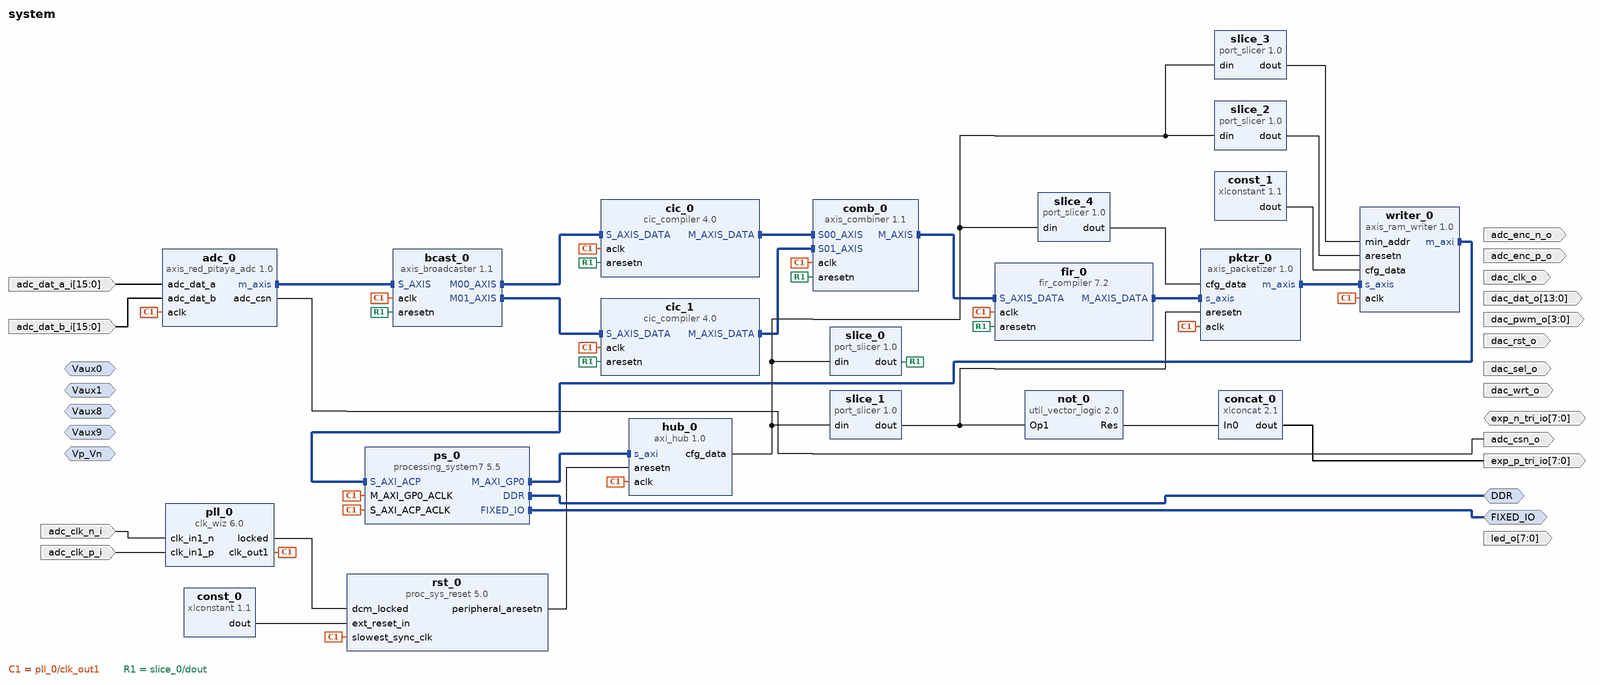
[diagram p0: block diagram of the top level]
# Vivado block design system, xc7z010clg400-1, Vivado 2023.2
create_bd_design system

create_bd_intf_port -mode Slave -vlnv xilinx.com:interface:diff_analog_io_rtl:1.0 Vp_Vn
create_bd_intf_port -mode Slave -vlnv xilinx.com:interface:diff_analog_io_rtl:1.0 Vaux0
create_bd_intf_port -mode Slave -vlnv xilinx.com:interface:diff_analog_io_rtl:1.0 Vaux1
create_bd_intf_port -mode Slave -vlnv xilinx.com:interface:diff_analog_io_rtl:1.0 Vaux9
create_bd_intf_port -mode Slave -vlnv xilinx.com:interface:diff_analog_io_rtl:1.0 Vaux8
create_bd_intf_port -mode Master -vlnv xilinx.com:interface:ddrx_rtl:1.0 DDR
create_bd_intf_port -mode Master -vlnv xilinx.com:display_processing_system7:fixedio_rtl:1.0 FIXED_IO
create_bd_port -dir I -from 15 -to 0 adc_dat_a_i
create_bd_port -dir I -from 15 -to 0 adc_dat_b_i
create_bd_port -dir I adc_clk_p_i
create_bd_port -dir I adc_clk_n_i
create_bd_port -dir O adc_enc_p_o
create_bd_port -dir O adc_enc_n_o
create_bd_port -dir O adc_csn_o
create_bd_port -dir O -from 13 -to 0 dac_dat_o
create_bd_port -dir O dac_clk_o
create_bd_port -dir O dac_rst_o
create_bd_port -dir O dac_sel_o
create_bd_port -dir O dac_wrt_o
create_bd_port -dir O -from 3 -to 0 dac_pwm_o
create_bd_port -dir IO -from 7 -to 0 exp_n_tri_io
create_bd_port -dir O -from 7 -to 0 led_o
create_bd_port -dir O -from 7 -to 0 exp_p_tri_io

create_bd_cell -type ip -vlnv xilinx.com:ip:clk_wiz:6.0 pll_0
set_property -dict [list \
  CONFIG.CLKOUT1_REQUESTED_OUT_FREQ 125.0 \
  CONFIG.CLKOUT1_USED true \
  CONFIG.PRIMITIVE PLL \
  CONFIG.PRIM_IN_FREQ 125.0 \
  CONFIG.PRIM_SOURCE Differential_clock_capable_pin \
  CONFIG.USE_RESET false \
] [get_bd_cells pll_0]
create_bd_cell -type ip -vlnv xilinx.com:ip:processing_system7:5.5 ps_0
set_property -dict [list \
  CONFIG.PCW_APU_PERIPHERAL_FREQMHZ 666.666666 \
  CONFIG.PCW_ENET0_ENET0_IO {MIO 16 .. 27} \
  CONFIG.PCW_ENET0_GRP_MDIO_ENABLE 1 \
  CONFIG.PCW_ENET0_GRP_MDIO_IO {MIO 52 .. 53} \
  CONFIG.PCW_ENET0_PERIPHERAL_ENABLE 1 \
  CONFIG.PCW_ENET0_RESET_ENABLE 0 \
  CONFIG.PCW_ENET_RESET_ENABLE 1 \
  CONFIG.PCW_ENET_RESET_SELECT {Share reset pin} \
  CONFIG.PCW_FPGA0_PERIPHERAL_FREQMHZ 50 \
  CONFIG.PCW_FPGA1_PERIPHERAL_FREQMHZ 50 \
  CONFIG.PCW_GPIO_EMIO_GPIO_ENABLE 1 \
  CONFIG.PCW_GPIO_EMIO_GPIO_IO 64 \
  CONFIG.PCW_GPIO_MIO_GPIO_ENABLE 1 \
  CONFIG.PCW_GPIO_MIO_GPIO_IO MIO \
  CONFIG.PCW_GPIO_PERIPHERAL_ENABLE 1 \
  CONFIG.PCW_I2C0_GRP_INT_ENABLE 0 \
  CONFIG.PCW_I2C0_I2C0_IO {MIO 50 .. 51} \
  CONFIG.PCW_I2C0_PERIPHERAL_ENABLE 1 \
  CONFIG.PCW_I2C_PERIPHERAL_FREQMHZ 111.111115 \
  CONFIG.PCW_I2C_RESET_ENABLE 1 \
  CONFIG.PCW_I2C_RESET_SELECT {Share reset pin} \
  CONFIG.PCW_IMPORT_BOARD_PRESET cfg/red_pitaya.xml \
  CONFIG.PCW_PRESET_BANK1_VOLTAGE {LVCMOS 2.5V} \
  CONFIG.PCW_QSPI_PERIPHERAL_ENABLE 0 \
  CONFIG.PCW_SD0_GRP_CD_ENABLE 1 \
  CONFIG.PCW_SD0_GRP_CD_IO {MIO 46} \
  CONFIG.PCW_SD0_GRP_WP_ENABLE 1 \
  CONFIG.PCW_SD0_GRP_WP_IO {MIO 47} \
  CONFIG.PCW_SD0_PERIPHERAL_ENABLE 1 \
  CONFIG.PCW_SD0_SD0_IO {MIO 40 .. 45} \
  CONFIG.PCW_SDIO_PERIPHERAL_FREQMHZ 100 \
  CONFIG.PCW_SPI0_PERIPHERAL_ENABLE 1 \
  CONFIG.PCW_SPI0_SPI0_IO EMIO \
  CONFIG.PCW_SPI1_PERIPHERAL_ENABLE 1 \
  CONFIG.PCW_SPI1_SPI1_IO {MIO 10 .. 15} \
  CONFIG.PCW_UART0_PERIPHERAL_ENABLE 1 \
  CONFIG.PCW_UART0_UART0_IO {MIO 14 .. 15} \
  CONFIG.PCW_UART1_PERIPHERAL_ENABLE 1 \
  CONFIG.PCW_UART1_UART1_IO {MIO 8 .. 9} \
  CONFIG.PCW_UART_PERIPHERAL_FREQMHZ 100 \
  CONFIG.PCW_UIPARAM_DDR_BUS_WIDTH {16 Bit} \
  CONFIG.PCW_UIPARAM_DDR_FREQ_MHZ 533.333333 \
  CONFIG.PCW_UIPARAM_DDR_PARTNO {MT41J256M16 RE-125} \
  CONFIG.PCW_USB0_PERIPHERAL_ENABLE 1 \
  CONFIG.PCW_USB0_RESET_ENABLE 1 \
  CONFIG.PCW_USB0_RESET_IO {MIO 48} \
  CONFIG.PCW_USB0_USB0_IO {MIO 28 .. 39} \
  CONFIG.PCW_USB_RESET_ENABLE 1 \
  CONFIG.PCW_USB_RESET_SELECT {Share reset pin} \
  CONFIG.PCW_USE_DEFAULT_ACP_USER_VAL 1 \
  CONFIG.PCW_USE_S_AXI_ACP 1 \
] [get_bd_cells ps_0]
# 429 more settings of ps_0 are not shown: defaults, MIO pin electricals, DDR timing, and values the tool derives
create_bd_cell -type ip -vlnv xilinx.com:ip:xlconstant:1.1 const_0
create_bd_cell -type ip -vlnv xilinx.com:ip:proc_sys_reset:5.0 rst_0
create_bd_cell -type ip -vlnv pavel-demin:user:axis_red_pitaya_adc:1.0 adc_0
set_property -dict {CONFIG.ADC_DATA_WIDTH 14} [get_bd_cells adc_0]
create_bd_cell -type ip -vlnv pavel-demin:user:axi_hub:1.0 hub_0
set_property -dict {CONFIG.CFG_DATA_WIDTH 96 CONFIG.STS_DATA_WIDTH 32} [get_bd_cells hub_0]
create_bd_cell -type ip -vlnv pavel-demin:user:port_slicer:1.0 slice_0
set_property -dict {CONFIG.DIN_FROM 0 CONFIG.DIN_TO 0 CONFIG.DIN_WIDTH 96} [get_bd_cells slice_0]
create_bd_cell -type ip -vlnv pavel-demin:user:port_slicer:1.0 slice_1
set_property -dict {CONFIG.DIN_FROM 1 CONFIG.DIN_TO 1 CONFIG.DIN_WIDTH 96} [get_bd_cells slice_1]
create_bd_cell -type ip -vlnv pavel-demin:user:port_slicer:1.0 slice_2
set_property -dict {CONFIG.DIN_FROM 2 CONFIG.DIN_TO 2 CONFIG.DIN_WIDTH 96} [get_bd_cells slice_2]
create_bd_cell -type ip -vlnv pavel-demin:user:port_slicer:1.0 slice_3
set_property -dict {CONFIG.DIN_FROM 63 CONFIG.DIN_TO 32 CONFIG.DIN_WIDTH 96} [get_bd_cells slice_3]
create_bd_cell -type ip -vlnv pavel-demin:user:port_slicer:1.0 slice_4
set_property -dict {CONFIG.DIN_FROM 95 CONFIG.DIN_TO 64 CONFIG.DIN_WIDTH 96} [get_bd_cells slice_4]
create_bd_cell -type ip -vlnv xilinx.com:ip:util_vector_logic:2.0 not_0
set_property -dict {CONFIG.C_OPERATION not CONFIG.C_SIZE 1} [get_bd_cells not_0]
create_bd_cell -type ip -vlnv xilinx.com:ip:xlconcat:2.1 concat_0
set_property -dict {CONFIG.IN0_WIDTH 1 CONFIG.IN1_WIDTH 7 CONFIG.NUM_PORTS 2} [get_bd_cells concat_0]
create_bd_cell -type ip -vlnv xilinx.com:ip:axis_broadcaster:1.1 bcast_0
set_property -dict [list \
  CONFIG.M00_TDATA_REMAP {tdata[15:0]} \
  CONFIG.M01_TDATA_REMAP {tdata[31:16]} \
  CONFIG.M_TDATA_NUM_BYTES 2 \
  CONFIG.S_TDATA_NUM_BYTES 4 \
] [get_bd_cells bcast_0]
create_bd_cell -type ip -vlnv xilinx.com:ip:cic_compiler:4.0 cic_0
set_property -dict [list \
  CONFIG.Clock_Frequency 125 \
  CONFIG.Filter_Type Decimation \
  CONFIG.Fixed_Or_Initial_Rate 32 \
  CONFIG.HAS_ARESETN true \
  CONFIG.Input_Data_Width 14 \
  CONFIG.Input_Sample_Frequency 125 \
  CONFIG.Number_Of_Stages 6 \
  CONFIG.Output_Data_Width 16 \
  CONFIG.Quantization Truncation \
  CONFIG.Use_Xtreme_DSP_Slice true \
] [get_bd_cells cic_0]
create_bd_cell -type ip -vlnv xilinx.com:ip:cic_compiler:4.0 cic_1
set_property -dict [list \
  CONFIG.Clock_Frequency 125 \
  CONFIG.Filter_Type Decimation \
  CONFIG.Fixed_Or_Initial_Rate 32 \
  CONFIG.HAS_ARESETN true \
  CONFIG.Input_Data_Width 14 \
  CONFIG.Input_Sample_Frequency 125 \
  CONFIG.Number_Of_Stages 6 \
  CONFIG.Output_Data_Width 16 \
  CONFIG.Quantization Truncation \
  CONFIG.Use_Xtreme_DSP_Slice true \
] [get_bd_cells cic_1]
create_bd_cell -type ip -vlnv xilinx.com:ip:axis_combiner:1.1 comb_0
set_property -dict {CONFIG.TDATA_NUM_BYTES 2} [get_bd_cells comb_0]
create_bd_cell -type ip -vlnv xilinx.com:ip:fir_compiler:7.2 fir_0
set_property -dict [list \
  CONFIG.BestPrecision true \
  CONFIG.CoefficientVector {['-1.64753028794138e-08, -4.72969860103254e-08, -7.81983994864729e-10, 3.09179315378013e-08, 1.8600476137934e-08, 3.27300695910419e-08, -6.27121813377163e-09, -1.52196115352429e-07,', '-8.30377969926702e-08, 3.14361841397898e-07, 3.05515872274853e-07, -4.73906648324436e-07, -7.13188274738437e-07, 5.47004771774003e-07, 1.33401100809314e-06, -4.13867548024707e-07,', '-2.14949555259695e-06, -6.77977800948474e-08, 3.07398932714553e-06, 1.0366230107463e-06, -3.94245232963009e-06, -2.59076839821521e-06, 4.51317323767107e-06, 4.74563996488482e-06,', '-4.49064349142054e-06, -7.3947777960083e-06, 3.57041197419745e-06, 1.02846684426837e-05, -1.50308472093842e-06, -1.30146997163052e-05, -1.8311731233767e-06, 1.50710364353895e-05, 6.3515248701083e-06,', '-1.58982472678568e-05, -1.17267343142635e-05, 1.50041199296265e-05, 1.73635115814309e-05, -1.20890304109726e-05, -2.24560062957254e-05, 7.16700059796055e-06, 2.60907689345942e-05,', '-6.64193032293714e-07, -2.74163749798938e-05, -6.54632074532538e-06, 2.5852558776971e-05, 1.31966582845397e-05, -2.13079073598636e-05, -1.77801135294917e-05, 1.43611952054032e-05,', '1.88093817512436e-05, -6.35698021047062e-06, -1.51543007857966e-05, -6.31269475321274e-07, 6.41236246473726e-06, 4.00235076480002e-06, 6.75384652715119e-06, -1.00102812372645e-06,', '-2.23907547607786e-05, -1.07614170164429e-05, 3.72128949266483e-05, 3.26888314865614e-05, -4.68343172264928e-05, -6.46247522446593e-05, 4.62331324663801e-05, 0.000104353987875991,', '-3.05204178369922e-05, -0.000147387572103254, -4.12376672483791e-06, 0.000187096070793206, 5.94492160104715e-05, -0.000215270553995213, -0.000134242574203586, 0.000223115373945588,', '0.000223732063932204, -0.000202601585158347, -0.000319473722277179, 0.000148023831554525, 0.000409856470754451, -5.75319241913947e-05, -0.00048128691789378, -6.56435551088113e-05,', '0.000520005389882914, 0.000212559310978688, -0.000514378040456993, -0.000368824791639381, 0.000457257636791032, 0.00051572189965271, -0.000348325111720936, -0.000632574861580132, 0.000195575644936742,', '0.000699853643923955, -1.5816811333843e-05, -0.000702875004558909, -0.000166267212059945, 0.000635554670416145, 0.000320646045613507, -0.000503596369030625, -0.000416023690327203,', '0.000326453158345306, 0.00042516016658693, -0.000137454215410763, -0.000330867755122004, -1.83577770104995e-05, 0.000131884375290827, 8.88732824246191e-05, 0.000152320700965935, -2.19145324792827e-05,', '-0.000478845867687744, -0.000226130995959082, 0.000781165284659716, 0.000680083599509367, -0.000973297239795462, -0.00133684955123469, 0.000956951103249511, 0.00215724393391554, -0.000632647805407322,', '-0.00306094569410801, -8.63474252426424e-05, 0.00392560461099799, 0.00125840455441931, -0.00459097537930345, -0.00289777037472875, 0.00486843895178868, 0.00496041688761007, -0.00455566278421732,', '-0.0073332195556104, 0.00345548961533671, 0.00982788076765724, -0.0013975392826423, -0.0121803938743171, -0.00173944634676796, 0.0140556603140014, 0.00600554245501628, -0.0150585666700821,', '-0.0113645359721422, 0.0147416608531572, 0.0176785888467245, -0.0126130926725902, -0.0247012339350495, 0.00812796467212303, 0.0320712315374266, -0.000646259298618774, -0.0392988478933562,', '-0.0106852885932714, 0.0457163887873562, 0.0272344645510023, -0.0503010855018923, -0.0516879242105393, 0.0510032995068897, 0.0905252892059647, -0.0416077244968566, -0.163677972614864,', '-0.0107434888500177, 0.356350050991766, 0.554721342376512, 0.356350050991766, -0.0107434888500177, -0.163677972614864, -0.0416077244968565, 0.0905252892059646, 0.0510032995068897, -0.0516879242105392,', '-0.0503010855018923, 0.0272344645510023, 0.0457163887873562, -0.0106852885932714, -0.0392988478933562, -0.000646259298618766, 0.0320712315374266, 0.008127964672123, -0.0247012339350495,', '-0.0126130926725902, 0.0176785888467245, 0.0147416608531572, -0.0113645359721422, -0.0150585666700821, 0.00600554245501627, 0.0140556603140014, -0.00173944634676796, -0.0121803938743171,', '-0.0013975392826423, 0.00982788076765723, 0.00345548961533672, -0.0073332195556104, -0.00455566278421732, 0.00496041688761004, 0.00486843895178868, -0.00289777037472874, -0.00459097537930345,', '0.00125840455441931, 0.003925604610998, -8.6347425242651e-05, -0.00306094569410801, -0.000632647805407327, 0.00215724393391554, 0.000956951103249513, -0.00133684955123469, -0.000973297239795458,', '0.00068008359950937, 0.000781165284659718, -0.000226130995959085, -0.000478845867687734, -2.19145324792814e-05, 0.000152320700965923, 8.88732824246168e-05, 0.000131884375290828, -1.83577770104952e-05,', '-0.000330867755122008, -0.000137454215410769, 0.000425160166586931, 0.000326453158345309, -0.000416023690327193, -0.000503596369030629, 0.000320646045613497, 0.000635554670416148,', '-0.000166267212059939, -0.000702875004558908, -1.58168113338674e-05, 0.000699853643923955, 0.000195575644936758, -0.000632574861580132, -0.000348325111720941, 0.000515721899652708,', '0.000457257636791035, -0.000368824791639379, -0.000514378040456997, 0.000212559310978687, 0.000520005389882915, -6.56435551088096e-05, -0.000481286917893776, -5.7531924191395e-05,', '0.000409856470754451, 0.000148023831554525, -0.000319473722277176, -0.000202601585158348, 0.000223732063932204, 0.000223115373945587, -0.000134242574203588, -0.000215270553995212, 5.944921601047e-05,', '0.000187096070793206, -4.12376672483805e-06, -0.000147387572103254, -3.05204178369924e-05, 0.000104353987875991, 4.62331324663777e-05, -6.46247522446589e-05, -4.68343172264921e-05,', '3.26888314865612e-05, 3.72128949266458e-05, -1.07614170164428e-05, -2.23907547607785e-05, -1.0010281237264e-06, 6.7538465271515e-06, 4.00235076480007e-06, 6.41236246473652e-06, -6.31269475321259e-07,', '-1.5154300785797e-05, -6.35698021047036e-06, 1.88093817512439e-05, 1.43611952054029e-05, -1.77801135294911e-05, -2.13079073598635e-05, 1.31966582845395e-05, 2.58525587769708e-05,', '-6.54632074532428e-06, -2.74163749798938e-05, -6.64193032294061e-07, 2.60907689345942e-05, 7.16700059796085e-06, -2.24560062957254e-05, -1.20890304109726e-05, 1.7363511581431e-05,', '1.50041199296266e-05, -1.17267343142635e-05, -1.58982472678571e-05, 6.3515248701082e-06, 1.50710364353894e-05, -1.83117312337678e-06, -1.30146997163053e-05, -1.50308472093845e-06,', '1.02846684426836e-05, 3.57041197419745e-06, -7.39477779600816e-06, -4.49064349142055e-06, 4.74563996488478e-06, 4.51317323767109e-06, -2.59076839821518e-06, -3.94245232963005e-06,', '1.03662301074629e-06, 3.07398932714552e-06, -6.77977800948646e-08, -2.14949555259695e-06, -4.13867548024735e-07, 1.33401100809314e-06, 5.47004771773993e-07, -7.13188274738437e-07,', '-4.73906648324394e-07, 3.05515872274853e-07, 3.14361841397861e-07, -8.30377969926656e-08, -1.5219611535243e-07, -6.27121813377245e-09, 3.27300695910341e-08, 1.86004761379317e-08, 3.0917931537805e-08,', '-7.81983994865244e-10, -4.72969860103212e-08, -1.64753028794135e-08']} \
  CONFIG.Coefficient_Width 16 \
  CONFIG.Data_Width 16 \
  CONFIG.Decimation_Rate 2 \
  CONFIG.Filter_Type Decimation \
  CONFIG.Has_ARESETn true \
  CONFIG.M_DATA_Has_TREADY true \
  CONFIG.Number_Paths 2 \
  CONFIG.Output_Rounding_Mode Truncate_LSBs \
  CONFIG.Output_Width 16 \
  CONFIG.Quantization Quantize_Only \
  CONFIG.RateSpecification Input_Sample_Period \
  CONFIG.SamplePeriod 32 \
] [get_bd_cells fir_0]
create_bd_cell -type ip -vlnv pavel-demin:user:axis_packetizer:1.0 pktzr_0
set_property -dict {CONFIG.AXIS_TDATA_WIDTH 32 CONFIG.CNTR_WIDTH 32 CONFIG.CONTINUOUS FALSE} [get_bd_cells pktzr_0]
create_bd_cell -type ip -vlnv xilinx.com:ip:xlconstant:1.1 const_1
set_property -dict {CONFIG.CONST_VAL 262143 CONFIG.CONST_WIDTH 18} [get_bd_cells const_1]
create_bd_cell -type ip -vlnv pavel-demin:user:axis_ram_writer:1.0 writer_0
set_property -dict [list \
  CONFIG.ADDR_WIDTH 18 \
  CONFIG.AXIS_TDATA_WIDTH 32 \
  CONFIG.AXI_ID_WIDTH 3 \
  CONFIG.FIFO_WRITE_DEPTH 1024 \
] [get_bd_cells writer_0]

# ---- connections ----

connect_bd_intf_net [get_bd_intf_pins bcast_0/S_AXIS] [get_bd_intf_pins adc_0/m_axis]
connect_bd_intf_net [get_bd_intf_pins cic_0/S_AXIS_DATA] [get_bd_intf_pins bcast_0/M00_AXIS]
connect_bd_intf_net [get_bd_intf_pins cic_1/S_AXIS_DATA] [get_bd_intf_pins bcast_0/M01_AXIS]
connect_bd_intf_net [get_bd_intf_pins comb_0/S00_AXIS] [get_bd_intf_pins cic_0/M_AXIS_DATA]
connect_bd_intf_net [get_bd_intf_pins comb_0/S01_AXIS] [get_bd_intf_pins cic_1/M_AXIS_DATA]
connect_bd_intf_net [get_bd_intf_pins fir_0/S_AXIS_DATA] [get_bd_intf_pins comb_0/M_AXIS]
connect_bd_intf_net [get_bd_intf_pins pktzr_0/s_axis] [get_bd_intf_pins fir_0/M_AXIS_DATA]
connect_bd_intf_net [get_bd_intf_pins writer_0/s_axis] [get_bd_intf_pins pktzr_0/m_axis]
connect_bd_intf_net [get_bd_intf_ports DDR] [get_bd_intf_pins ps_0/DDR]
connect_bd_intf_net [get_bd_intf_ports FIXED_IO] [get_bd_intf_pins ps_0/FIXED_IO]
connect_bd_intf_net [get_bd_intf_pins hub_0/s_axi] [get_bd_intf_pins ps_0/M_AXI_GP0]
connect_bd_intf_net [get_bd_intf_pins writer_0/m_axi] [get_bd_intf_pins ps_0/S_AXI_ACP]
connect_bd_net [get_bd_pins adc_0/adc_csn] [get_bd_ports adc_csn_o]
connect_bd_net [get_bd_ports adc_clk_n_i] [get_bd_pins pll_0/clk_in1_n]
connect_bd_net [get_bd_ports adc_clk_p_i] [get_bd_pins pll_0/clk_in1_p]
connect_bd_net [get_bd_ports adc_dat_a_i] [get_bd_pins adc_0/adc_dat_a]
connect_bd_net [get_bd_ports adc_dat_b_i] [get_bd_pins adc_0/adc_dat_b]
connect_bd_net [get_bd_pins concat_0/dout] [get_bd_ports exp_p_tri_io]
connect_bd_net [get_bd_pins const_0/dout] [get_bd_pins rst_0/ext_reset_in]
connect_bd_net [get_bd_pins const_1/dout] [get_bd_pins writer_0/cfg_data]
connect_bd_net [get_bd_pins hub_0/cfg_data] \
  [get_bd_pins slice_0/din] [get_bd_pins slice_1/din] [get_bd_pins slice_2/din] [get_bd_pins slice_3/din] \
  [get_bd_pins slice_4/din]
connect_bd_net [get_bd_pins not_0/Res] [get_bd_pins concat_0/In0]
connect_bd_net [get_bd_pins pll_0/clk_out1] \
  [get_bd_pins ps_0/M_AXI_GP0_ACLK] [get_bd_pins ps_0/S_AXI_ACP_ACLK] [get_bd_pins rst_0/slowest_sync_clk] \
  [get_bd_pins adc_0/aclk] [get_bd_pins hub_0/aclk] [get_bd_pins bcast_0/aclk] [get_bd_pins cic_0/aclk] \
  [get_bd_pins cic_1/aclk] [get_bd_pins comb_0/aclk] [get_bd_pins fir_0/aclk] [get_bd_pins pktzr_0/aclk] \
  [get_bd_pins writer_0/aclk]
connect_bd_net [get_bd_pins pll_0/locked] [get_bd_pins rst_0/dcm_locked]
connect_bd_net [get_bd_pins rst_0/peripheral_aresetn] [get_bd_pins hub_0/aresetn]
connect_bd_net [get_bd_pins slice_0/dout] \
  [get_bd_pins bcast_0/aresetn] [get_bd_pins cic_0/aresetn] [get_bd_pins cic_1/aresetn] [get_bd_pins comb_0/aresetn] \
  [get_bd_pins fir_0/aresetn]
connect_bd_net [get_bd_pins slice_1/dout] [get_bd_pins not_0/Op1] [get_bd_pins pktzr_0/aresetn]
connect_bd_net [get_bd_pins slice_2/dout] [get_bd_pins writer_0/aresetn]
connect_bd_net [get_bd_pins slice_3/dout] [get_bd_pins writer_0/min_addr]
connect_bd_net [get_bd_pins slice_4/dout] [get_bd_pins pktzr_0/cfg_data]

validate_bd_design
save_bd_design
